# EAGLE design rs485board (EAGLE 8.7.0)
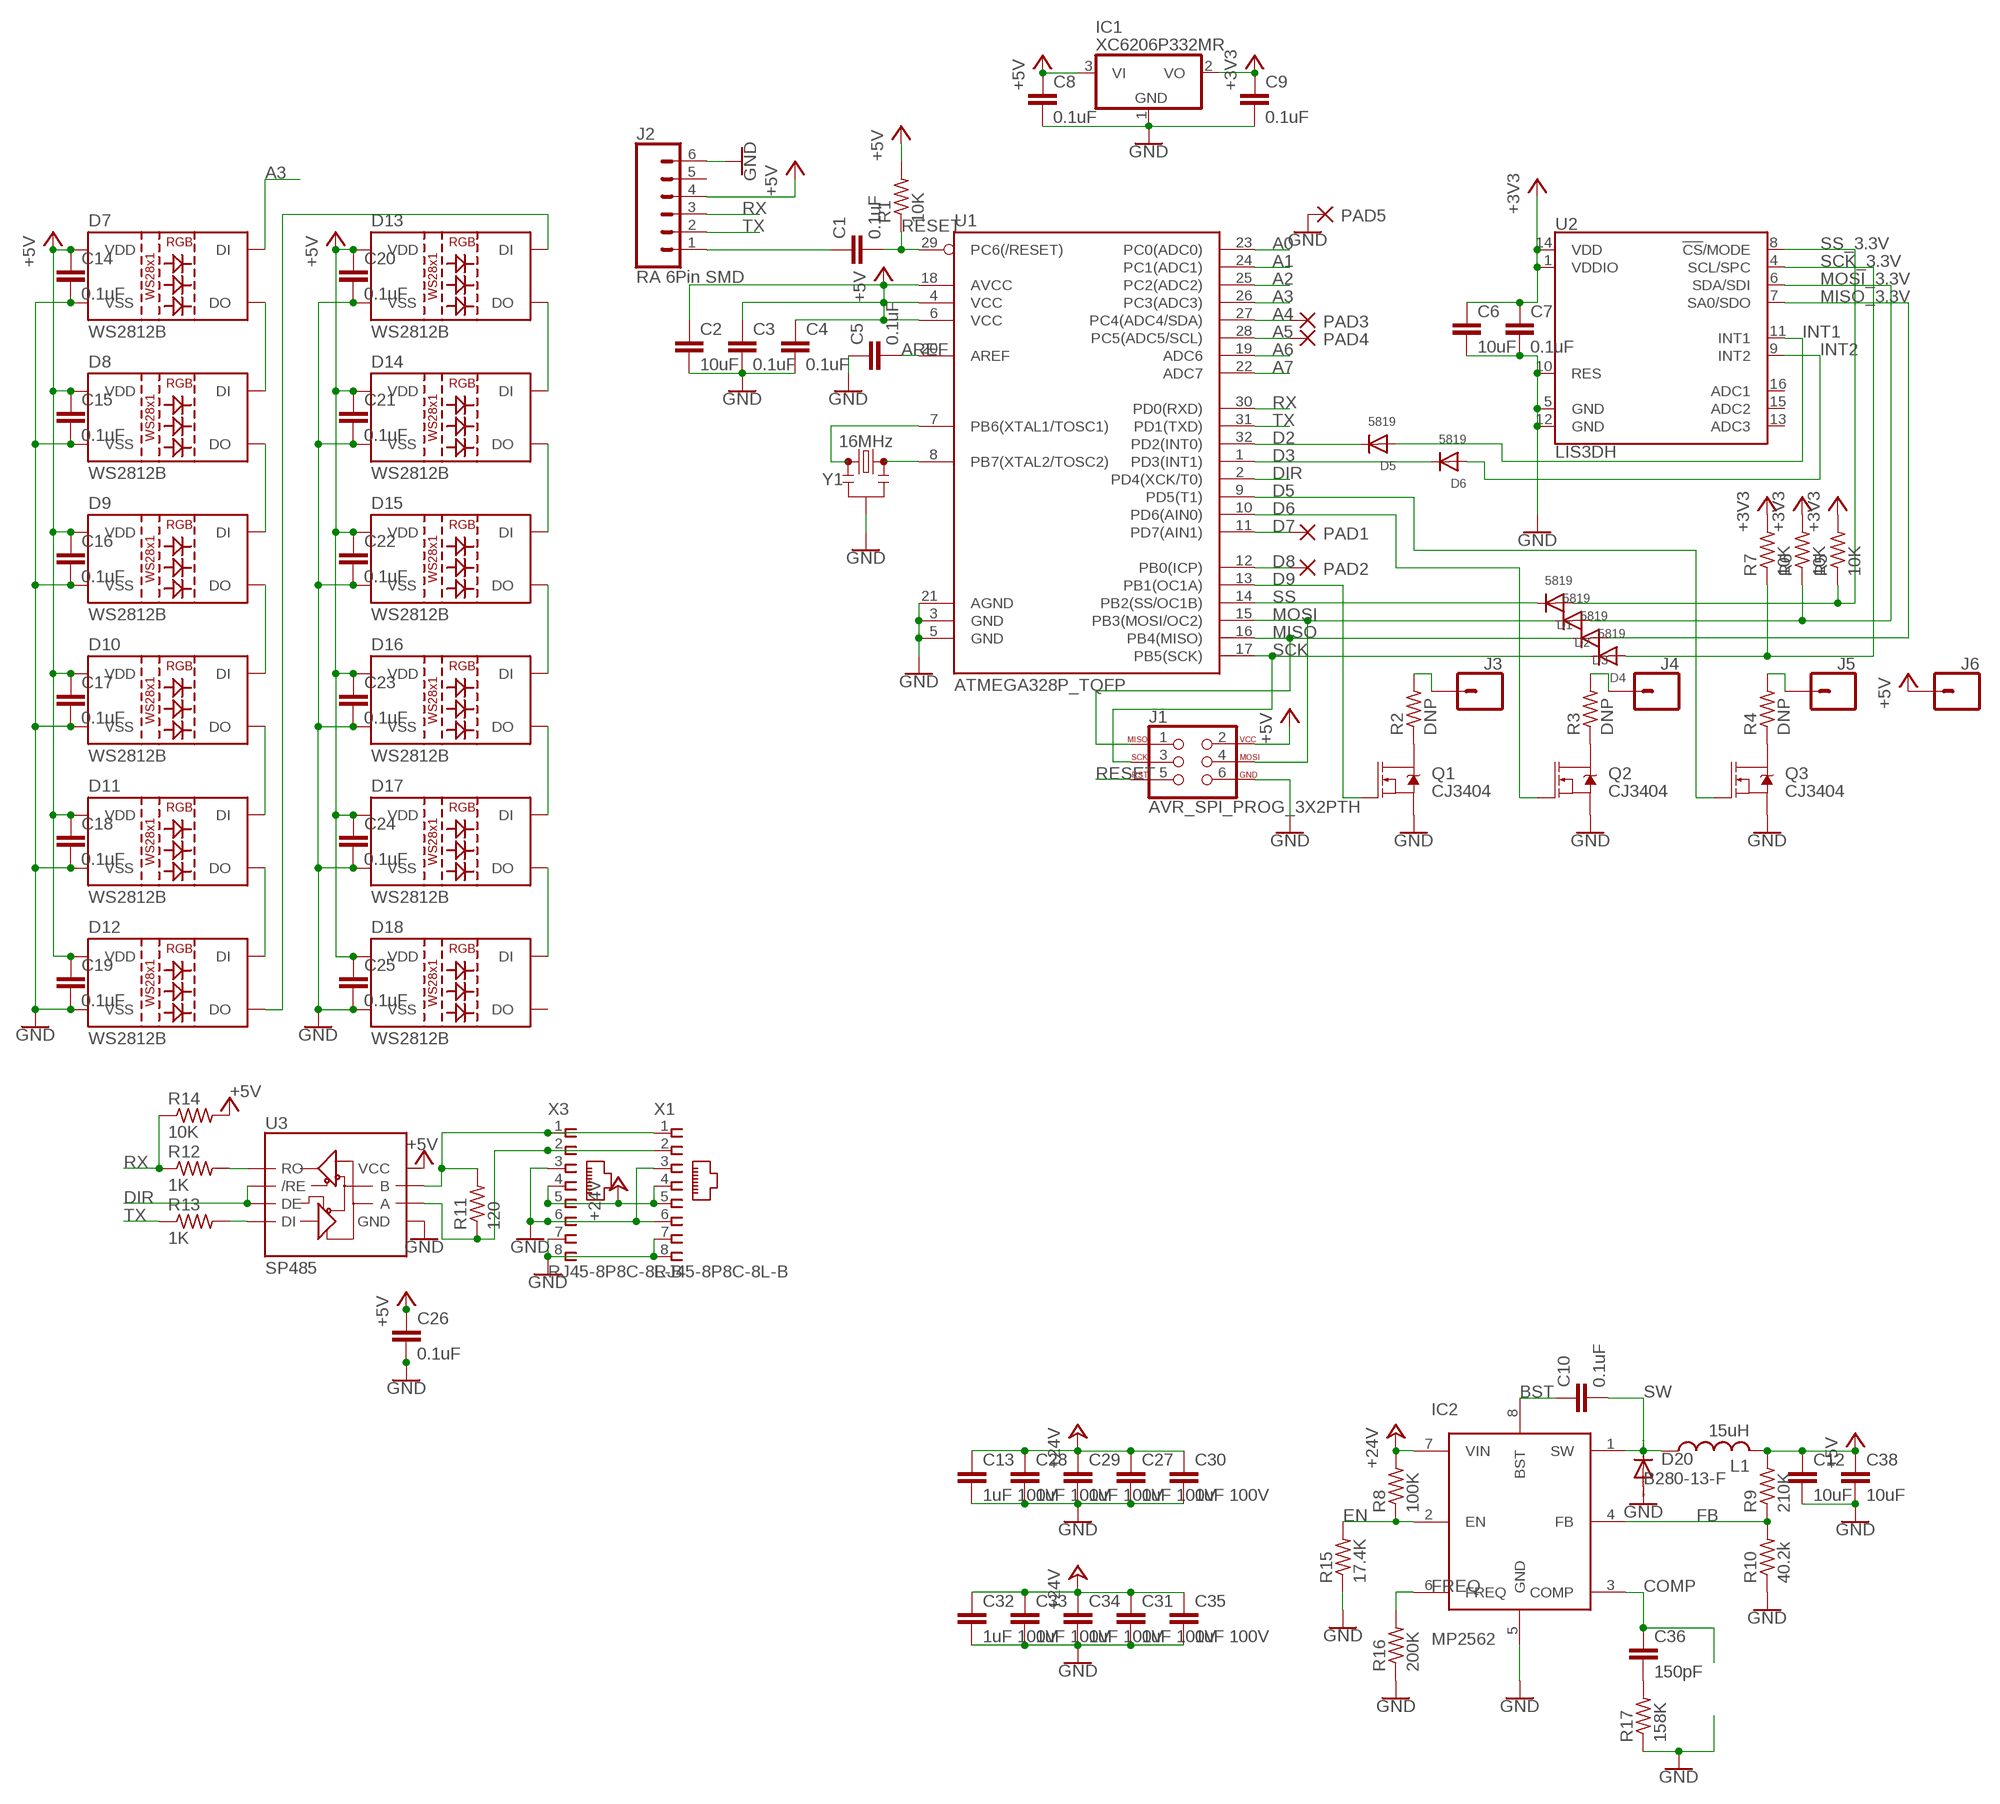
[diagram p0: schematic, sheet 1]

## Parts
C1  0.1uF  C-EUC0805K  [C0805K]
C2  10uF  C-EUC0805K  [C0805K]
C3  0.1uF  C-EUC0805K  [C0805K]
C4  0.1uF  C-EUC0805K  [C0805K]
C5  0.1uF  C-EUC0805K  [C0805K]
C6  10uF  C-EUC0805K  [C0805K]
C7  0.1uF  C-EUC0805K  [C0805K]
C8  0.1uF  C-EUC0805K  [C0805K]
C9  0.1uF  C-EUC0805K  [C0805K]
C10  0.1uF  C-EUC0805K  [C0805K]
C12  10uF  C-EUC0805K  [C0805K]
C13  1uF 100V  10UF-1206-6.3V-20%  [1206]
C14  0.1uF  C-EUC0805K  [C0805K]
C15  0.1uF  C-EUC0805K  [C0805K]
C16  0.1uF  C-EUC0805K  [C0805K]
C17  0.1uF  C-EUC0805K  [C0805K]
C18  0.1uF  C-EUC0805K  [C0805K]
C19  0.1uF  C-EUC0805K  [C0805K]
C20  0.1uF  C-EUC0805K  [C0805K]
C21  0.1uF  C-EUC0805K  [C0805K]
C22  0.1uF  C-EUC0805K  [C0805K]
C23  0.1uF  C-EUC0805K  [C0805K]
C24  0.1uF  C-EUC0805K  [C0805K]
C25  0.1uF  C-EUC0805K  [C0805K]
C26  0.1uF  C-EUC0805K  [C0805K]
C27  1uF 100V  10UF-1206-6.3V-20%  [1206]
C28  1uF 100V  10UF-1206-6.3V-20%  [1206]
C29  1uF 100V  10UF-1206-6.3V-20%  [1206]
C30  1uF 100V  10UF-1206-6.3V-20%  [1206]
C31  1uF 100V  10UF-1206-6.3V-20%  [1206]
C32  1uF 100V  10UF-1206-6.3V-20%  [1206]
C33  1uF 100V  10UF-1206-6.3V-20%  [1206]
C34  1uF 100V  10UF-1206-6.3V-20%  [1206]
C35  1uF 100V  10UF-1206-6.3V-20%  [1206]
C36  150pF  C-EUC0805K  [C0805K]
C38  10uF  C-EUC0805K  [C0805K]
D1  5819  DIODESOD-123  [SOD-123]
D2  5819  DIODESOD-123  [SOD-123]
D3  5819  DIODESOD-123  [SOD-123]
D4  5819  DIODESOD-123  [SOD-123]
D5  5819  DIODESOD-123  [SOD-123]
D6  5819  DIODESOD-123  [SOD-123]
D7  WS2812B  [WS2812B]
D8  WS2812B  [WS2812B]
D9  WS2812B  [WS2812B]
D10  WS2812B  [WS2812B]
D11  WS2812B  [WS2812B]
D12  WS2812B  [WS2812B]
D13  WS2812B  [WS2812B]
D14  WS2812B  [WS2812B]
D15  WS2812B  [WS2812B]
D16  WS2812B  [WS2812B]
D17  WS2812B  [WS2812B]
D18  WS2812B  [WS2812B]
D20  B280-13-F  DIODE-DO214AA  [DO214AA]
IC1  XC6206P332MR  MCP1703CB  [SOT23]
IC2  MP2562  [SO08]
J1  AVR_SPI_PROG_3X2PTH  [2X3]
J2  RA 6Pin SMD  CONN_06SMD  [1X06-SMD_RA_MALE]
J3  CONN_01  [1X01]
J4  CONN_01  [1X01]
J5  CONN_01  [1X01]
J6  CONN_01  [1X01]
L1  15uH  SLF12575T  [SLF12575]
PAD1  1,6/0,8  [1,6/0,8]
PAD2  1,6/0,8  [1,6/0,8]
PAD3  1,6/0,8  [1,6/0,8]
PAD4  1,6/0,8  [1,6/0,8]
PAD5  1,6/0,8  [1,6/0,8]
Q1  CJ3404  MOSFET-NCH-AO3404A  [SOT23-3]
Q2  CJ3404  MOSFET-NCH-AO3404A  [SOT23-3]
Q3  CJ3404  MOSFET-NCH-AO3404A  [SOT23-3]
R1  10K  R-US_R0805  [R0805]
R2  DNP  R-US_R0805  [R0805]
R3  DNP  R-US_R0805  [R0805]
R4  DNP  R-US_R0805  [R0805]
R5  10K  R-US_R0805  [R0805]
R6  10K  R-US_R0805  [R0805]
R7  10K  R-US_R0805  [R0805]
R8  100K  R-US_R0805  [R0805]
R9  210K  R-US_R0805  [R0805]
R10  40.2k  R-US_R0805  [R0805]
R11  120  R-US_R0805  [R0805]
R12  1K  R-US_R0805  [R0805]
R13  1K  R-US_R0805  [R0805]
R14  10K  R-US_R0805  [R0805]
R15  17.4K  R-US_R0805  [R0805]
R16  200K  R-US_R0805  [R0805]
R17  158K  R-US_R0805  [R0805]
U1  ATMEGA328P_TQFP  [TQFP32-08]
U2  LIS3DH  [LGA-16-3X3]
U3  SP485  RS485SOIC  [SO08]
X1  RJ45-8P8C-8L-B  [RJ45-SHIELD-DS1128-S80BP]
X3  RJ45-8P8C-8L-B  [RJ45-SHIELD-DS1128-S80BP]
Y1  16MHz  RESONATOR-16MHZSMD_3.2X1.3  [RESONATOR-SMD-3.2X1.3]

## Nets
+3V3: C6.1 C7.1 C9.1 IC1.2(VO) R5.2 R6.2 R7.2 U2.1(VDDIO) U2.14(VDD)
+5V: C2.1 C3.1 C4.1 C8.1 C12.1 C14.1 C15.1 C16.1 C17.1 C18.1 C19.1 C20.1 C21.1 C22.1 C23.1 C24.1 C25.1 C26.1 C38.1 D7.1(VDD) D8.1(VDD) D9.1(VDD) D10.1(VDD) D11.1(VDD) D12.1(VDD) D13.1(VDD) D14.1(VDD) D15.1(VDD) D16.1(VDD) D17.1(VDD) D18.1(VDD) IC1.3(VI) J1.2 J2.4 J6.1 L1.P$2 R1.2 R9.2 R14.2 U1.4(VCC) U1.6(VCC) U1.18(AVCC) U3.8(VCC)
+24V: C13.1 C27.1 C28.1 C29.1 C30.1 C31.1 C32.1 C33.1 C34.1 C35.1 IC2.7(VIN) R8.2 X1.4 X1.5 X3.4 X3.5
A0: U1.23(PC0(ADC0))
A1: U1.24(PC1(ADC1))
A2: U1.25(PC2(ADC2))
A3: D7.4(DI) U1.26(PC3(ADC3))
A4: PAD3.1(P) U1.27(PC4(ADC4/SDA))
A5: PAD4.1(P) U1.28(PC5(ADC5/SCL))
A6: U1.19(ADC6)
A7: U1.22(ADC7)
AREF: C5.2 U1.20(AREF)
BST: C10.1 IC2.8(BST)
COMP: C36.1 IC2.3(COMP)
D2: D5.C U1.32(PD2(INT0))
D3: D6.C U1.1(PD3(INT1))
D5: Q3.1(G) U1.9(PD5(T1))
D6: Q2.1(G) U1.10(PD6(AIN0))
D7: PAD1.1(P) U1.11(PD7(AIN1))
D8: PAD2.1(P) U1.12(PB0(ICP))
D9: Q1.1(G) U1.13(PB1(OC1A))
DIR: U1.2(PD4(XCK/T0)) U3.2(/RE) U3.3(DE)
EN: IC2.2(EN) R8.1 R15.2
FB: IC2.4(FB) R9.1 R10.2
FREQ: IC2.6(FREQ) R16.2
GND: C2.2 C3.2 C4.2 C5.1 C6.2 C7.2 C8.2 C9.2 C12.2 C13.2 C14.2 C15.2 C16.2 C17.2 C18.2 C19.2 C20.2 C21.2 C22.2 C23.2 C24.2 C25.2 C26.2 C27.2 C28.2 C29.2 C30.2 C31.2 C32.2 C33.2 C34.2 C35.2 C38.2 D7.3(VSS) D8.3(VSS) D9.3(VSS) D10.3(VSS) D11.3(VSS) D12.3(VSS) D13.3(VSS) D14.3(VSS) D15.3(VSS) D16.3(VSS) D17.3(VSS) D18.3(VSS) D20.A IC1.1(GND) IC2.5(GND) J1.6 J2.6 PAD5.1(P) Q1.2(S) Q2.2(S) Q3.2(S) R10.1 R15.1 R16.1 R17.1 U1.3(GND) U1.5(GND) U1.21(AGND) U2.5(GND) U2.10(RES) U2.12(GND) U3.5(GND) X1.3 X1.6 X1.7 X1.8 X3.3 X3.6 X3.7 X3.8 Y1.2
INT1: D5.A U2.11(INT1)
INT2: D6.A U2.9(INT2)
MISO: D3.C J1.1 U1.16(PB4(MISO))
MISO_3.3V: D3.A U2.7(SA0/SDO)
MOSI: D2.C J1.4 U1.15(PB3(MOSI/OC2))
MOSI_3.3V: D2.A R6.1 U2.6(SDA/SDI)
N$1: Q1.3(D) R2.1
N$2: D7.2(DO) D8.4(DI)
N$3: D8.2(DO) D9.4(DI)
N$4: J3.1 R2.2
N$5: Q2.3(D) R3.1
N$6: J4.1 R3.2
N$7: Q3.3(D) R4.1
N$8: J5.1 R4.2
N$9: D9.2(DO) D10.4(DI)
N$10: D10.2(DO) D11.4(DI)
N$11: D11.2(DO) D12.4(DI)
N$12: D12.2(DO) D13.4(DI)
N$13: D13.2(DO) D14.4(DI)
N$14: D14.2(DO) D15.4(DI)
N$15: D15.2(DO) D16.4(DI)
N$16: D16.2(DO) D17.4(DI)
N$17: D17.2(DO) D18.4(DI)
N$25: C36.2 R17.2
N$30: R12.2 U3.1(RO)
N$31: R13.2 U3.4(DI)
RESET: C1.2 J1.5 R1.1 U1.29(PC6(/RESET))
RESET_EXT: C1.1 J2.1
RS485A: R11.1 U3.6(A) X1.2 X3.2
RS485B: R11.2 U3.7(B) X1.1 X3.1
RX: J2.3 R12.1 R14.1 U1.30(PD0(RXD))
SCK: D4.C J1.3 U1.17(PB5(SCK))
SCK_3.3V: D4.A R7.1 U2.4(SCL/SPC)
SS: D1.C U1.14(PB2(SS/OC1B))
SS_3.3V: D1.A R5.1 U2.8(!CS!/MODE)
SW: C10.2 D20.C IC2.1(SW) L1.P$1
TX: J2.2 R13.1 U1.31(PD1(TXD))
XTAL1: U1.7(PB6(XTAL1/TOSC1)) Y1.1
XTAL2: U1.8(PB7(XTAL2/TOSC2)) Y1.3
Unconnected: D18.2(DO) J2.5 U2.13(ADC3) U2.15(ADC2) U2.16(ADC1)

## Library data of the parts
C1 C3-C5 C7-C10 C14-C26 = resistor:C-EU: CAPACITOR, European symbol; LCSC: C29926
C2 C6 C12 C38 = resistor:C-EU: CAPACITOR, European symbol; LCSC: C92341
C13 C27-C35 = SparkFun-Capacitors:10UF: 10.0µF ceramic capacitors A capacitor is a passive two-terminal electrical component used to store electrical energy temporarily in an electric field.; LCSC: C91151; PROD_ID: CAP-10057; VALUE: 10uF
C36 = resistor:C-EU: CAPACITOR, European symbol; LCSC: C152846
D1-D6 = adafruit:DIODE: Diode SMADIODE - SMA Surface Mount Package 20V 1A Schottky Diode Digikey: 641-1014-6-ND DO-1N4148 - Through Hole Small Current Diode SOD-123 20V 1 A (.5mV Vf) Schottky Diode - Digikey: MBRX120TPMSCT-ND SOD-323 10V 570mA (.38mV Vf, 3ns) Schottky Diode - Digikey: ZLLS410CT-ND SOD-523 30V 30mA Schottky Diode (RB751S-40TE61) - Digikey: RB751S-40TE61CT-ND SOT23-R/W - SOT23 Package (R = Solder Paste/Reflow Ovens, W = Hand-Soldering) BAT54Film 40V 300mA - Digikey: 497-7162-1-ND; LCSC: C64885
D7-D18 = SparkFun-LED:WS2812B: WS2812B SMD addressable RGB LED 5x5mm SMD LED with built-in controller IC. Color: Red/Green/Blue mC Rating: RGB: 390, 660, 180 mcd Forward Voltage: RGB: 2.0, 3.0, 3.0 V Packages:WS2812B SparkFun Products: Blynk Board - ESP8266 <https://www.sparkfun.com/products/13794>; LCSC: C114585; PROD_ID: DIO-12503
D20 = diode:DIODE-: DIODE; LCSC: C134445
IC1 = linear:MCP1703: 250 mA, 16V, Low Quiescent Current LDO Regulator Source: http://ww1.microchip.com/downloads/en/DeviceDoc/22049b.pdf; LCSC: C5446
IC2 = misc:MP2562; LCSC: C93647
J1 = SparkFun-Connectors:AVR_SPI_PROG_3X2: AVR ISP 6 Pin This is the reduced ISP connector for AVR programming. Common on Arduino. This footprint will take up less PCB space and can be used with a 10-pin to 6-pin adapter such as SKU: BOB-08508 **Special note about "TEST_POINT" package. The stop mask is on the top side, so if you want your programming test points to be on the bottom of your board, make sure to place this package on the bottom side of the board. This also ensure that the orientation to program from the bottom side will be correct. SparkFun Products: SparkFun ISP Pogo Adapter <https://www.sparkfun.com/products/11591> - NS Tiny AVR Programmer <https://www.sparkfun.com/products/11801> -PTH
J2 = SparkFun-Connectors:CONN_06: Multi connection point. Often used as Generic Header-pin footprint for 0.1 inch spaced/style header connections On any of the 0.1 inch spaced packages, you can populate with these: Break Away Headers - Straight <https://www.sparkfun.com/products/116> (PRT-00116) Break Away Male Headers - Right Angle <https://www.sparkfun.com/products/553> (PRT-00553) Female Headers <https://www.sparkfun.com/products/115> (PRT-00115) Break Away Headers - Machine Pin <https://www.sparkfun.com/products/117> (PRT-00117) Break Away Female Headers - Swiss Machine Pin <https://www.sparkfun.com/products/743> (PRT-00743) Arduino Stackable Header - 6 Pin <https://www.sparkfun.com/products/9280> (PRT-09280) For SCREWTERMINALS and SPRING TERMINALS visit here: Screw Terimnals on SparkFun.com <https://www.sparkfun.com/search/results?term=Screw+Terminals> (5mm/3.5mm/2.54mm spacing) This device is also useful as a general connection point to wire up your design to another part of your project. Our various solder wires solder well into these plated through hole pads. Hook-Up Wire - Assortment (Stranded, 22 AWG) <https://www.sparkfun.com/products/11375> (PRT-11375) Hook-Up Wire - Assortment (Solid Core, 22 AWG) <https://www.sparkfun.com/products/11367> (PRT-11367) View the entire wire category on our website here <https://www.sparkfun.com/categories/141>; PROD_ID: CONN-08971
J3-J6 = SparkFun-Connectors:CONN_01: Single connection point. Often used as Generic Header-pin footprint for 0.1 inch spaced/style header connections On any of the 0.1 inch spaced packages, you can populate with these: Break Away Headers - Straight <https://www.sparkfun.com/products/116> (PRT-00116) Break Away Male Headers - Right Angle <https://www.sparkfun.com/products/553> (PRT-00553) Female Headers <https://www.sparkfun.com/products/115> (PRT-00115) Break Away Headers - Machine Pin <https://www.sparkfun.com/products/117> (PRT-00117) Break Away Female Headers - Swiss Machine Pin <https://www.sparkfun.com/products/743> (PRT-00743) This device is also useful as a general connection point to wire up your design to another part of your project. Our various solder wires solder well into these plated through hole pads. Hook-Up Wire - Assortment (Stranded, 22 AWG) <https://www.sparkfun.com/products/11375> (PRT-11375) Hook-Up Wire - Assortment (Solid Core, 22 AWG) <https://www.sparkfun.com/products/11367> (PRT-11367) View the entire wire category on our website here <https://www.sparkfun.com/categories/141> Special notes: SMTSO-256-ET is a "flush mount" nut for a 4-40 screw. We mostly use this on specialty testbeds; it is a nice way to connect hardware to your PCB at an adjustable hieght. Also note, the SNAP packages are for using a snappable style connector. We sell a baggie of snaps and they are also used on two LilyPad designs: Snap Assortment - 30 pack (male and female) <https://www.sparkfun.com/products/11347> (DEV-11347) LilyPad Arduino SimpleSnap <https://www.sparkfun.com/products/10941> (DEV-10941) LilyPad SimpleSnap Protoboard <https://www.sparkfun.com/products/10940> (DEV-10940)
L1 = misc:SLF12575T; LCSC: C136211
PAD1-PAD5 = wirepad:1,6/0,8: THROUGH-HOLE PAD
Q1-Q3 = SparkFun-DiscreteSemi:MOSFET-NCH: N-channel MOSFETs Voltage controlled devices that allow control of high current outputs. SparkFun Products: SparkFun OpenScale <https://www.sparkfun.com/products/13261> SparkFun Digital Sandbox <https://www.sparkfun.com/products/12651> SparkFun Monster Moto Shield <https://www.sparkfun.com/products/10182> SparkFun MOSFET Power Controller <https://www.sparkfun.com/products/11214>; PROD_ID: TRANS-12988; VALUE: 5.8A/30V/35mΩ
R1 R5-R7 R14 = resistor:R-US_: RESISTOR, American symbol; LCSC: C17414
R2-R4 R11 = resistor:R-US_: RESISTOR, American symbol
R8 = resistor:R-US_: RESISTOR, American symbol; LCSC: C96346
R9 = resistor:R-US_: RESISTOR, American symbol; LCSC: C170839
R10 = resistor:R-US_: RESISTOR, American symbol; LCSC: C104303
R12 R13 = resistor:R-US_: RESISTOR, American symbol; LCSC: C115316
R15 = resistor:R-US_: RESISTOR, American symbol; LCSC: C144583
R16 = resistor:R-US_: RESISTOR, American symbol; LCSC: C17539
R17 = resistor:R-US_: RESISTOR, American symbol; LCSC: C104013
U1 = SparkFun-IC-Microcontroller:ATMEGA328P_TQFP: Popular 328P in QFP Storefront component: ATmega328 - TQFP <https://www.sparkfun.com/products/13448> (COM-13448) Datasheet <http://www.sparkfun.com/datasheets/Components/SMD/ATMega328.pdf> SparkFun Products SparkFun RedBoard - Programmed with Arduino <https://www.sparkfun.com/products/12757> (DEV-12757) Arduino Pro Mini 328 - 5V/16MHz <https://www.sparkfun.com/products/11113> (DEV-11113) Arduino Pro Mini 328 - 3.3V/8MHz <https://www.sparkfun.com/products/11114> (DEV-11114) SparkFun OpenLog <https://www.sparkfun.com/products/13712> (DEV-13712) SparkFun MicroView - OLED Arduino Module <https://www.sparkfun.com/products/12923> (DEV-12923) SparkFun Digital Sandbox <https://www.sparkfun.com/products/12651> (DEV-12651) SparkFun PicoBoard <https://www.sparkfun.com/products/11888> (WIG-11888) Arduino Fio <https://www.sparkfun.com/products/10116> (DEV-10116) LilyPad Arduino 328 Main Board <https://www.sparkfun.com/products/13342> (DEV-13342) SparkFun RedStick <https://www.sparkfun.com/products/13741> (DEV-13741) LilyPad MP3 <https://www.sparkfun.com/products/11013> (DEV-11013) LilyPad Arduino SimpleSnap <https://www.sparkfun.com/products/10941> (DEV-10941) SparkFun Stepoko <https://www.sparkfun.com/products/13899> (ROB-13899) SparkFun Geiger Counter <https://www.sparkfun.com/products/11345> (SEN-11345) SparkFun EL Sequencer <https://www.sparkfun.com/products/12781> (COM-12781) Arduino Pro 328 - 5V/16MHz <https://www.sparkfun.com/products/10915> (DEV-10915) CryptoCape <https://www.sparkfun.com/products/12773> (DEV-12773) SparkFun IR Thermometer Evaluation Board - MLX90614 <https://www.sparkfun.com/products/10740> (SEN-10740) SparkFun RedBot Mainboard <https://www.sparkfun.com/products/12097> (ROB-12097) Arduino Pro 328 - 3.3V/8MHz <https://www.sparkfun.com/products/10914> (DEV-10914) SparkFun Block for Intel® Edison - Arduino <https://www.sparkfun.com/products/13036> (DEV-13036) SparkFun Simon Says - Surface Mount Soldering Kit <https://www.sparkfun.com/products/10935> (KIT-10935) SparkFun 7-Segment Serial Display - Red <https://www.sparkfun.com/products/11441> (COM-11441) SparkFun 7-Segment Serial Display - White <https://www.sparkfun.com/products/11629> (COM-11629) SparkFun 7-Segment Serial Display - Yellow <https://www.sparkfun.com/products/11443> (COM-11443) SparkFun 7-Segment Serial Display - Kelly Green <https://www.sparkfun.com/products/11440> (COM-11440) SparkFun 7-Segment Serial Display - Blue <https://www.sparkfun.com/products/11442> (COM-11442) SparkFun OpenSegment Serial Display - 20mm (Blue) <https://www.sparkfun.com/products/11647> (COM-11647) SparkFun OpenSegment Serial Display - 20mm (Green) <https://www.sparkfun.com/products/11646> (COM-11646) SparkFun OpenSegment Serial Display - 20mm (White) <https://www.sparkfun.com/products/11648> (COM-11648) SparkFun OpenSegment Serial Display - 20mm (Red) <https://www.sparkfun.com/products/11644> (COM-11644) SparkFun OpenSegment Serial Display - 20mm (Yellow) <https://www.sparkfun.com/products/11645> (COM-11645) SparkFun OpenSegment Shield <https://www.sparkfun.com/products/13190> (DEV-13190); LCSC: C14877; PROD_ID: IC-09069
U2 = SparkFun-Sensors:LIS3DH: ST Microelectronics LIS3DH 3-Axis ±2/4/8/16g SPI/I2C Accelerometer The LIS3DH is a three axis MEMS linear accelerometer in the "nano" family. It has a digital I2C/SPI serial interface which makes it ideal for using in embedded applications. The device also features ultra low-power operational modes that allow advanced power saving and smart sleep to wake-up functions, built in detections with interrupts, and auxiliary ADC inputs Datasheet-XXXX <http://www.sparkfun.com/datasheets/Sensors/Accelerometer/LIS3DH.pdf> SparkFun Products SparkFun Triple Axis Accelerometer Breakout - LIS3DH <https://www.sparkfun.com/products/10345> (SEN-XXXXX) Triple Axis Accelerometer - LIS3DH <https://www.sparkfun.com/products/9755> (SEN-XXXXX); LCSC: C15134; PROD_ID: IC-13419; SF_ID: N/A
U3 = SparkFun-IC-Comms:RS485: RS-485 Transceiver SP3485 Series 8 Pin NSOIC 3.3 V Low Power Half Duplex RS-485 Transceiver MAX3485 compatible Datasheet <http://www.sparkfun.com/datasheets/Components/General/sp3485CN-LTR.pdf> SparkFun Products SparkFun Transceiver Breakout - RS-485 <https://www.sparkfun.com/products/10124> (BOB-10124) SparkFun USB to RS-485 Converter <https://www.sparkfun.com/products/9822> (BOB-09822); LCSC: C6855; PROD_ID: IC-09388; VALUE: MAX3485CSA
X1 X3 = myownParts:RJ45-8P8C: CORCOM Modular RJ Jacks No Shield Source: www.tycoelectronics.com .. ENG_DS_1654001_1099_RJ_L_0507.pdf; LCSC: C86586; MF: TYCO ELECTRONICS; MPN: RJ45-8L-B; OC_FARNELL: 1279843; OC_NEWARK: 52K4445
Y1 = SparkFun-Clocks:RESONATOR-16MHZ: 16MHz Resonator Digikey Example <http://www.digikey.com/product-detail/en/murata-electronics-north-america/CSTCE16M0V53-R0/490-1198-1-ND/584635> Frequency: 16MHz Frequency Stability: ±0.3% Frequency Tolerance: ±0.5% Capacitance: 15pF SparkFun Products SparkFun OpenLog <https://www.sparkfun.com/products/13712> SparkFun MicroView - OLED Arduino Module <https://www.sparkfun.com/products/12923>; LCSC: C91584; PROD_ID: XTAL-08900

## Board
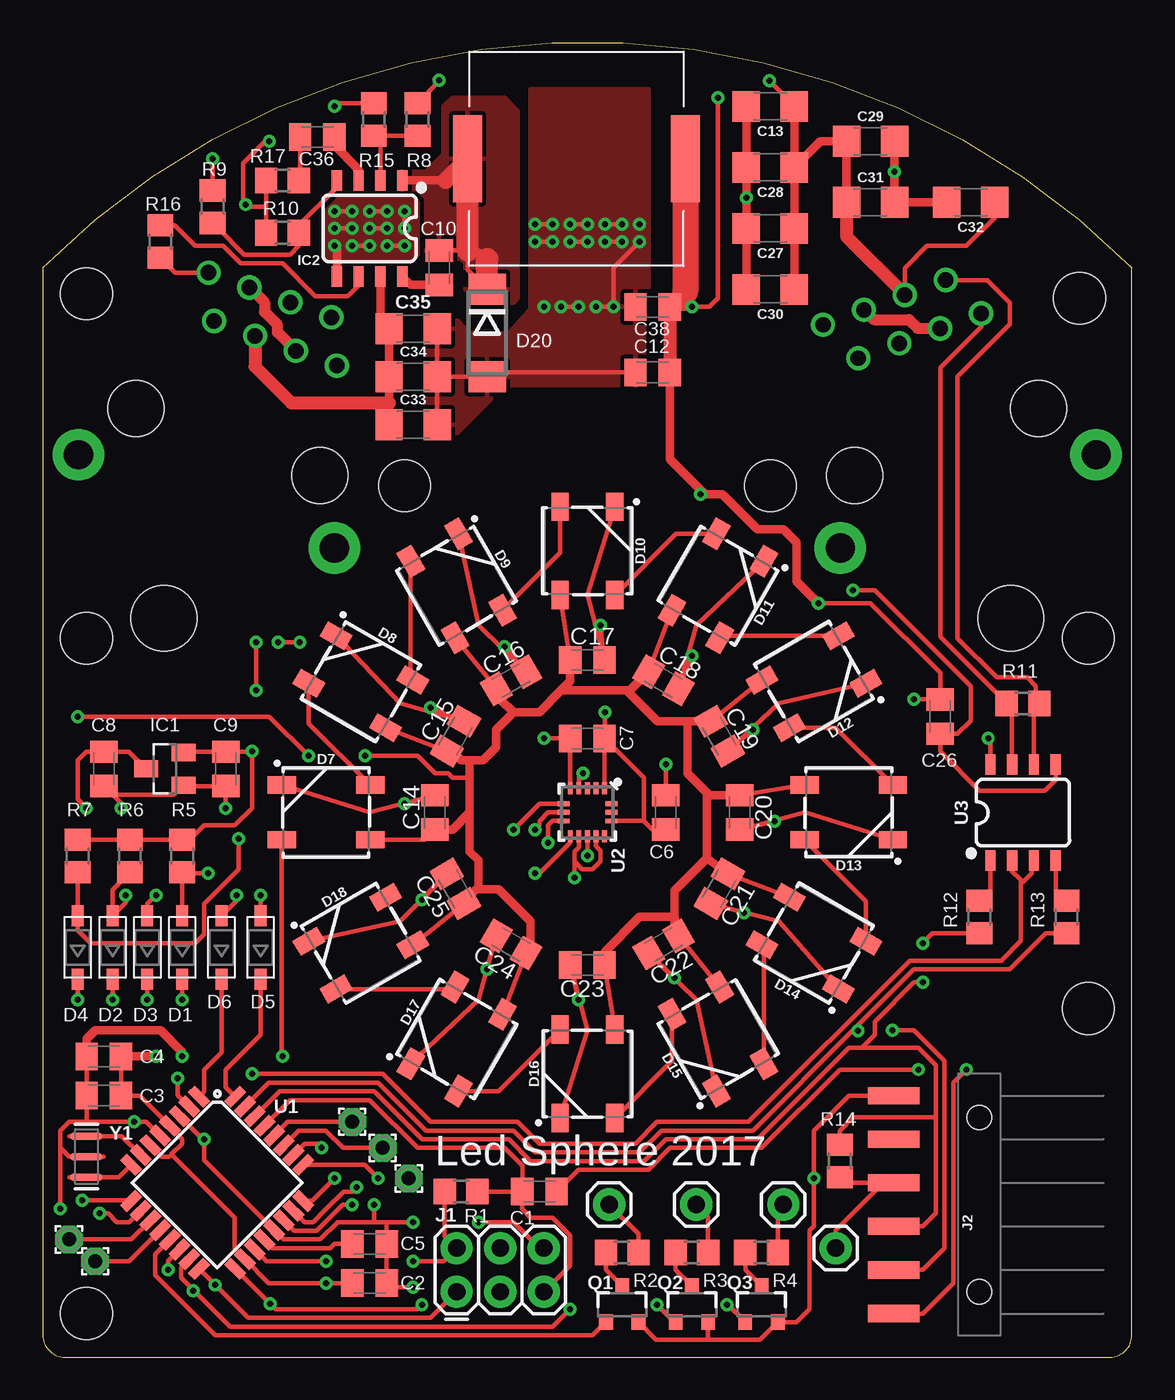
[diagram p1: board, top side]
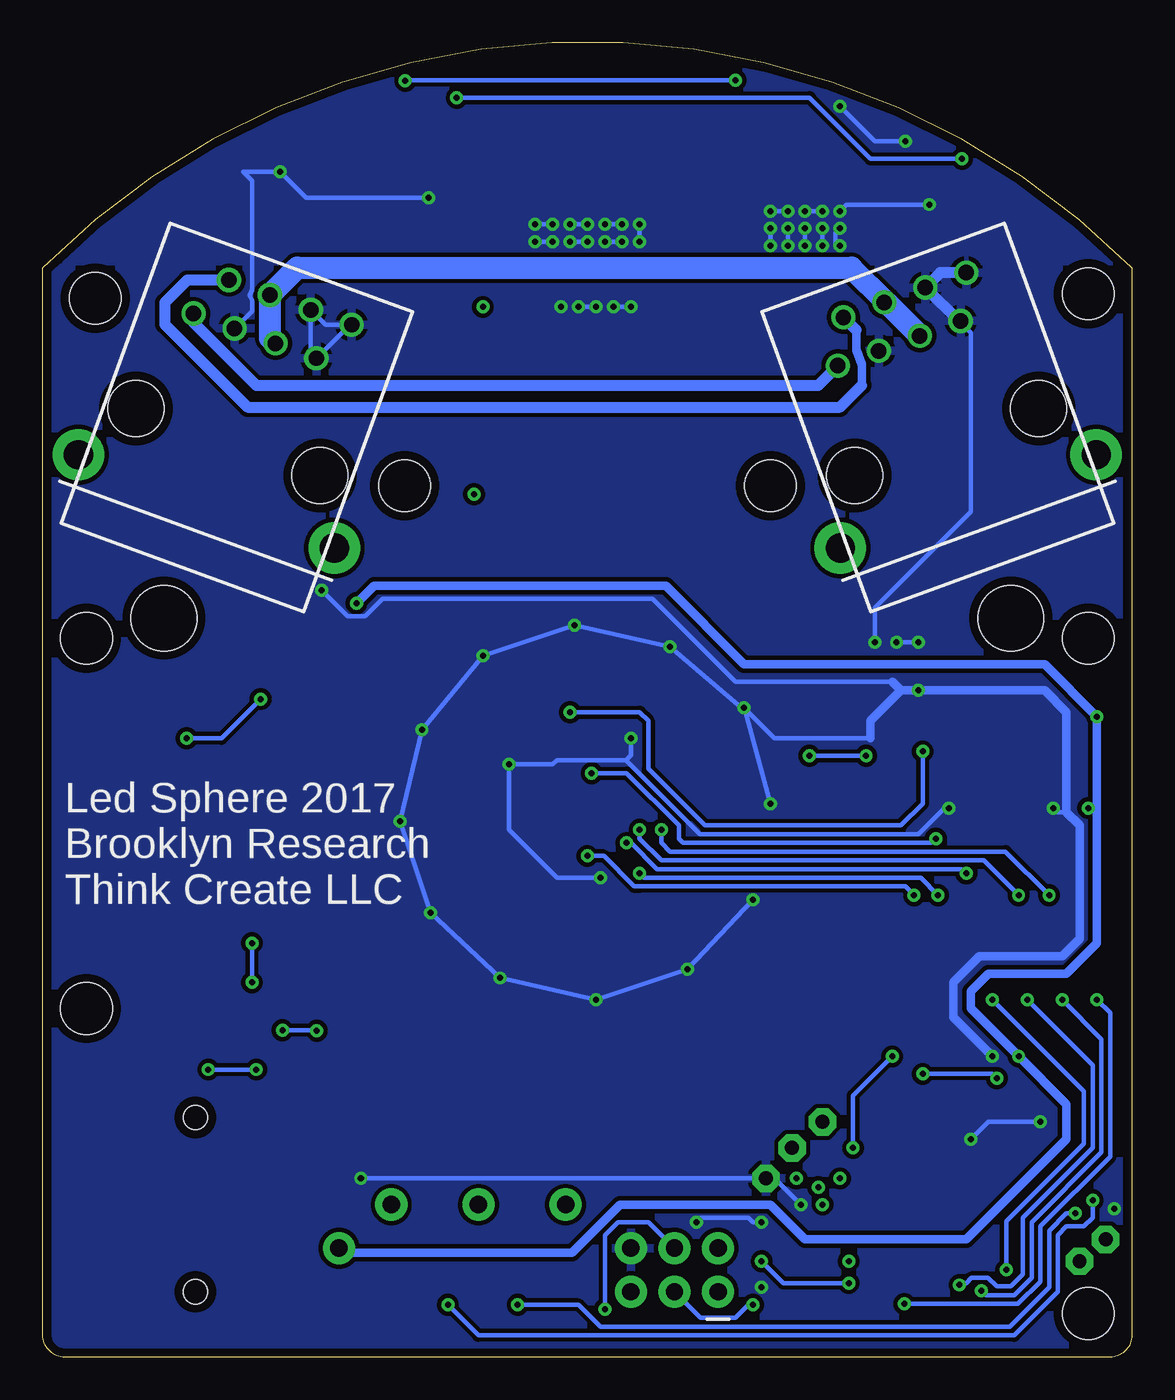
[diagram p2: board, bottom side, seen from below]

Size 63.5 x 76.6 mm. Coordinates in mm from the lower left corner, seen from the top.
Outline: 1.27,0 62.23,0 arc90 63.5,1.27 63.5,63.5 arc90 0,63.5 0,1.27 arc90 1.27,0
Copper layers (1*16): Top 0.035mm / dielectric 1.5mm / Bottom 0.035mm
Design rules "eagleRules *": minimum track width 10mil, minimum drill 0.3mm, track to track 10mil, track to pad 10mil, pad to pad 8mil, via to via 10mil, smd to smd 8mil, copper to edge 20mil, drill to drill 20mil, minimum pad ring 10mil, minimum via ring 8mil, stop-mask expansion 4mil, vias tented up to drill 14mil, thermal gap 10mil
Holes 3 mm at 2.54,2.54 60.96,20.32 2.54,41.91 60.96,41.91 21.08,50.8 42.42,50.8 2.54,61.98 60.45,61.72
Holes 3.81 mm at 7.06,43.08 56.44,43.08

### Footprints (pad centres in the part's own frame; a part is rotated, then mirrored left to right if it is on the bottom)
C0805K = smd 1.3 x 1.6: 1 -1,0; 2 1,0
1206 = smd 1.6 x 1.8: 1 -1.4,0; 2 1.4,0
SOD-123 = smd 1.2 x 0.7: A 1.85,0; C -1.85,0
WS2812B = smd 1.651 x 1: 1 2.577,-1.6; 2 2.577,1.6; 3 -2.577,1.6; 4 -2.577,-1.6
DO214AA = smd 1.8 x 2.2: A 2.55,0; C -2.55,0
SOT23 = smd 1 x 1.4: 1 -0.95,-1.1; 2 0.95,-1.1; 3 0,1.1
SO08 = smd 0.6 x 1.2: 1 -1.905,-2.8; 2 -0.635,-2.8; 3 0.635,-2.8; 4 1.905,-2.8; 5 1.905,2.8; 6 0.635,2.8; 7 -0.635,2.8; 8 -1.905,2.8
2X3 = drill 1.016 pad 1.88: 1 0,0; 2 0,2.54; 3 2.54,0; 4 2.54,2.54; 5 5.08,0; 6 5.08,2.54
1X06-SMD_RA_MALE = smd 1 x 3: 1 -6.35,5; 2 -3.81,5; 3 -1.27,5; 4 1.27,5; 5 3.81,5; 6 6.35,5 | hole 1.4: -5.08,0; 5.08,0
1X01 = drill 1.016 pad 1.88: 1 0,0
SLF12575 = smd 1.676 x 5.08: P$1 -6.35,0; P$2 6.35,0
1,6/0,8 = drill 0.813 pad 1.6 octagon: 1 0,0
SOT23-3 = smd 0.8 x 0.9: 1 -0.95,-1; 2 0.95,-1; 3 0,1.1
R0805 = smd 1.3 x 1.5: 1 -0.95,0; 2 0.95,0
TQFP32-08 = smd 1.27 x 0.559: 1 -4.293,2.8; 2 -4.293,2; 3 -4.293,1.2; 4 -4.293,0.4; 5 -4.293,-0.4; 6 -4.293,-1.2; 7 -4.293,-2; 8 -4.293,-2.8; 17 4.293,-2.8; 18 4.293,-2; 19 4.293,-1.2; 20 4.293,-0.4; 21 4.293,0.4; 22 4.293,1.2; 23 4.293,2; 24 4.293,2.8 | smd 0.559 x 1.27: 9 -2.8,-4.293; 10 -2,-4.293; 11 -1.2,-4.293; 12 -0.4,-4.293; 13 0.4,-4.293; 14 1.2,-4.293; 15 2,-4.293; 16 2.8,-4.293; 25 2.8,4.293; 26 2,4.293; 27 1.2,4.293; 28 0.4,4.293; 29 -0.4,4.293; 30 -1.2,4.293; 31 -2,4.293; 32 -2.8,4.293
LGA-16-3X3 = smd 0.7 x 0.28: 1 -1.4,1; 2 -1.4,0.5; 3 -1.4,0; 4 -1.4,-0.5; 5 -1.4,-1; 9 1.4,-1; 10 1.4,-0.5; 11 1.4,0; 12 1.4,0.5; 13 1.4,1 | smd 0.28 x 0.7: 6 -0.5,-1.4; 7 0,-1.4; 8 0.5,-1.4; 14 0.5,1.4; 15 0,1.4; 16 -0.5,1.4
RJ45-SHIELD-DS1128-S80BP = drill 0.9 pad 1.4: 1 -4.445,6.35; 2 -3.175,8.89; 3 -1.905,6.35; 4 -0.635,8.89; 5 0.635,6.35; 6 1.905,8.89; 7 3.175,6.35; 8 4.445,8.89 | drill 1.7 pad 3: SHIELD1 -7.94,-3.68; SHIELD2 7.94,-3.68 | hole 3.251: -5.715,0; 5.715,0
RESONATOR-SMD-3.2X1.3 = smd 0.45 x 1.905: 1 -1.2,0; 2 0,0; 3 1.2,0

### Placement (x,y rotation side)
C1  28.96,9.65 180 top
C2  19.05,4.32 0 top
C3  3.56,15.24 180 top
C4  3.56,17.53 180 top
C5  19.05,6.6 180 top
C6  36.32,31.75 90 top
C7  31.75,36.07 180 top
C8  3.56,34.29 270 top
C9  10.67,34.29 270 top
C10  23.11,63.5 90 top
C12  35.56,57.4 180 top
C13  42.42,72.9 180 top
C14  22.86,31.75 90 top
C15  24.05,36.2 60 top
C16  27.3,39.45 30 top
C17  31.75,40.64 0 top
C18  36.2,39.45 330 top
C19  39.45,36.2 300 top
C20  40.64,31.75 270 top
C21  39.45,27.3 240 top
C22  36.2,24.05 210 top
C23  31.75,22.86 180 top
C24  27.3,24.05 150 top
C25  24.05,27.3 120 top
C26  52.32,37.34 270 top
C27  42.42,65.79 180 top
C28  42.42,69.34 180 top
C29  48.26,70.87 0 top
C30  42.42,62.23 180 top
C31  48.26,67.31 0 top
C32  54.1,67.31 180 top
C33  21.59,54.36 0 top
C34  21.59,57.15 0 top
C35  21.59,59.94 0 top
C36  16,71.12 180 top
C38  35.56,61.21 180 top
D1  8.13,23.88 90 top
D2  4.06,23.88 90 top
D3  6.1,23.88 90 top
D4  2.03,23.88 90 top
D5  12.7,23.88 90 top
D6  10.41,23.88 90 top
D7  16.51,31.75 0 top
D8  18.54,39.37 330 top
D9  24.13,44.96 300 top
D10  31.75,46.99 270 top
D11  39.37,44.96 240 top
D12  44.96,39.37 210 top
D13  46.99,31.75 180 top
D14  44.96,24.13 150 top
D15  39.37,18.54 120 top
D16  31.75,16.51 90 top
D17  24.13,18.54 60 top
D18  18.54,24.13 30 top
D20  25.91,59.69 270 top
IC1  7.11,34.29 90 top
IC2  19.05,65.79 180 top
J1  24.13,3.81 0 top
J2  54.61,8.89 90 top
J3  33.02,8.89 0 top
J4  38.1,8.89 0 top
J5  43.18,8.89 0 top
J6  46.23,6.35 0 top
L1  31.11,69.85 0 top
PAD1  1.52,6.86 0 top
PAD2  3.05,5.59 0 top
PAD3  19.81,12.19 0 top
PAD4  18.03,13.72 0 top
PAD5  21.34,10.41 0 top
Q1  33.78,3.05 0 top
Q2  37.85,3.05 0 top
Q3  41.91,3.05 0 top
R1  24.38,9.65 180 top
R2  33.78,6.1 0 top
R3  37.85,6.1 0 top
R4  41.91,6.1 0 top
R5  8.13,29.21 90 top
R6  5.08,29.21 90 top
R7  2.03,29.21 90 top
R8  21.84,72.14 90 top
R9  9.91,67.06 90 top
R10  13.97,65.53 0 top
R11  57.15,38.1 180 top
R12  54.61,25.65 90 top
R13  59.69,25.65 90 top
R14  46.48,11.43 270 top
R15  19.3,72.14 270 top
R16  6.86,65.02 90 top
R17  13.97,68.58 0 top
U1  10.16,10.16 315 top
U2  31.75,31.75 270 top
U3  57.15,31.75 0 top
X1  52.7,53.34 340 bottom
X3  10.79,53.34 20 bottom
Y1  2.54,11.68 270 top

### Tracks (layer width: path | path; a pad name or v marks a point on that pad's centre or on a via)
+3V3  (via drill 0.35)
  Top 0.254: IC1.2 8.26,35.29 C9.1 12.18,35.29 v12.19,35.31 12.19,32 11.18,30.99 9.4,30.99 8.57,30.16 R5.2 R6.2 R7.2 | 32.89,35.94 32.77,36.07 C7.1 32.77,36.08 v32.77,37.59 | 32.89,35.94 35.05,33.78 35.05,31.24 | 35.05,31.24 35.56,30.73 36.31,30.73 C6.1 | U2.14 35.04,31.25 35.05,31.24 | U2.1 32.75,35.8 32.89,35.94
  Bottom 0.254: v32.77,37.59 28.7,37.59 28.19,37.08 28.19,34.29 24.89,30.99 13.46,30.99 12.19,32.26 v12.19,35.31
+5V  (via drill 0.35)
  Top 0.254: C8.1 5.01,35.29 IC1.3 | U1.6 6.94,11.68 7.37,11.68 7.49,11.81 | 7.49,11.81 8.13,12.45 8.13,12.7 7.41,13.42 U1.4 5.65,15.24 C3.1 C4.1 | 7.49,11.81 11.18,8.13 11.18,6.32 U1.18 13.17,4.32 v16.51,4.32 C2.1 | v21.59,5.59 23.37,5.59 J1.2 23.43,7.05 R1.2 | C8.1 3.56,35.81 | D13.1 C20.1 | D14.1 C21.1 | D16.1 C23.1 | D17.1 C24.1 28.45,23.83 | C25.1 D18.1 | C22.1 D15.1 | D8.1 C15.1 | D9.1 26.67,38.72 | D10.1 C17.1 | D11.1 C18.1 | D12.1 C19.1 | C8.1 2.52,35.29 2.03,34.8 2.03,32.51 v2.54,32 | D7.1 22.26,30.15 C14.1 | 24.89,33.78 23.88,33.78 23.62,34.04 22.86,34.04 21.84,35.05 v18.8,35.05 | v15.49,35.05 13.21,37.34 v2.03,37.34 | v50.8,38.35 52.31,38.35 C26.1 52.32,39.88 48.26,43.94 v45.21,43.94 | v55.12,36.07 55.24,35.94 U3.8 | J6.1 46.23,7.37 48.98,10.12 49.47,10.12 J2.4 46.8,10.16 R14.2 | v39.37,73.41 39.37,61.72 38.86,61.21 v37.85,61.21 | v9.91,69.85 R9.2
  Top 0.508: C4.1 v6.6,17.53 | 30.23,38.86 30.75,39.39 C17.1 | 30.23,38.86 28.96,37.59 27.43,37.59 | 27.43,37.59 26.67,38.35 26.67,38.72 C16.1 | 27.43,37.59 26.42,36.58 26.42,35.56 25.65,34.8 24.89,34.8 | 24.89,31.75 23.88,30.73 C14.1 | 24.89,31.75 24.89,29.46 25.4,28.96 25.4,27.43 | 25.4,27.43 25.4,27.29 26.56,27.29 28.45,25.4 28.45,23.83 | 34.04,38.86 30.23,38.86 | 34.04,38.86 34.24,38.86 C18.1 | 37.59,37.06 35.84,37.06 34.04,38.86 | 37.59,37.06 37.59,34.04 38.73,32.89 | 38.73,32.89 38.88,32.75 C20.1 | 38.73,32.89 38.73,29.08 | 38.73,29.08 36.83,27.18 36.83,25.4 | 36.83,25.4 36.83,24.79 | C19.1 37.59,37.06 | C21.1 38.73,29.08 | 36.83,25.4 C22.1 36.83,25.65 34.8,25.65 32.77,23.62 32.77,22.88 C23.1 | 25.4,27.43 C25.1 | C15.1 23.85,35.33 24.38,34.8 24.89,34.8 | 24.89,34.8 24.89,33.78 24.89,31.75 | v38.35,50.29 38.61,50.29 | 38.61,50.29 39.62,50.29 41.66,48.26 43.18,48.26 43.94,47.5 43.94,45.21 v45.21,43.94 | C38.1 v37.85,61.21 | C12.1 36.56,52.34 38.61,50.29
  Top 0.762: 37.47,62.12 C38.1 C12.1
  Top 1.524: L1.P$2 37.47,62.12
  Bottom 0.254: v16.51,4.32 20.32,4.32 v21.59,5.59 | v2.54,32 2.03,32 | v18.8,35.05 v15.49,35.05 | v50.8,38.35 53.09,36.07 v55.12,36.07 | v39.37,73.41 18.8,73.41 15.24,69.85 v9.91,69.85
  Bottom 0.508: J6.1 45.97,6.1 32.65,6.1 29.85,8.89 21.08,8.89 19.05,6.86 9.65,6.86 3.81,12.7 3.81,14.73 v6.6,17.53 9.4,20.32 9.4,21.34 8.38,22.35 3.81,22.35 2.03,24.13 2.03,32 v2.03,37.34 5.08,40.39 22.61,40.39 27.18,44.96 44.2,44.96 v45.21,43.94
+24V  (via drill 0.35)
  Top 0.254: 19.68,60.45 C35.1 | R8.2 23.11,74.36 v23.11,74.42 | v42.37,74.4 43.82,72.95 C13.1 | C32.1 55.5,66.42 53.85,64.77 51.56,64.77 50.26,63.47 X1.4
  Top 0.508: IC2.7 19.68,60.45 | C33.1 20.19,55.63 C35.1 C34.1 | C13.1 C28.1 | C28.1 C27.1 C30.1 | C31.1 C29.1 45.34,70.87 C28.1
  Top 0.762: C31.1 46.86,65.31 X1.4 | X3.5 12.37,57.73 14.48,55.63 20.19,55.63
  Bottom 0.254: v23.11,74.42 42.35,74.42 v42.37,74.4 | 14.32,61.48 X3.4
  Bottom 1.27: X3.5 14.32,61.48 16.35,63.5 48.67,63.5 X1.4 50.26,59.41 X1.5
A0  (via drill 0.35)
  Top 0.254: U1.23 15.27,7.87 15.75,7.87 16.51,8.64 | 16.51,8.64 | v18.29,9.91 18.03,9.65 17.52,9.65 16.51,8.64
A1  (via drill 0.35)
  Top 0.254: U1.24 15.71,9.11 v17.02,10.41
A2  (via drill 0.35)
  Top 0.254: U1.25 18.76,11.21 v19.56,10.41
A3  (via drill 0.35)
  Top 0.254: D7.4 13.93,17.56 v13.97,17.53 | U1.26 15.27,12.45 16,12.45 v16.26,12.19
  Bottom 0.254: v13.97,17.53 16.26,15.24 v16.26,12.19
A4
  Top 0.254: U1.27 14.9,13.21 16.49,13.21 17.51,12.19 PAD3.1
A5
  Top 0.254: U1.28 14.28,13.72 PAD4.1
A6  (via drill 0.35)
  Top 0.254: U1.19 13.04,5.59 v16.51,5.59
A7  (via drill 0.35)
  Top 0.254: U1.22 14.65,7.37 15.96,7.37 17.48,8.89 v18.03,8.89
AREF
  Top 0.254: U1.20 13.4,6.35 16.38,6.35 | 16.38,6.35 | 16.38,6.35 16.76,6.35 17.02,6.6 C5.2
BST
  Top 0.508: C10.1 21.44,62.5 IC2.8
COMP
  Top 0.254: 17,70.63 C36.1
  Top 0.508: IC2.3 18.41,69.22 17,70.63
D2
  Top 0.254: U1.32 10.67,15.72 10.67,16.76 12.7,18.8 D5.C
D3
  Top 0.254: D6.C 10.41,17.78 9.4,16.76 9.4,15.47 U1.1
D5  (via drill 0.35)
  Top 0.254: U1.9 5.11,9.14 v2.29,9.14 | v39.88,3.05 39.96,3.05 Q3.1
  Bottom 0.254: v2.29,9.14 2.29,8.13 2.79,7.62 3.81,7.62 4.32,7.11 4.32,3.81 6.86,1.27 38.1,1.27 v39.88,3.05
D6  (via drill 0.35)
  Top 0.254: U1.10 5.05,7.87 4.32,7.87 3.81,8.38 v3.3,8.38 | v35.81,3.05 36.81,2.05 Q2.1
  Bottom 0.254: v3.3,8.38 3.81,8.38 4.83,7.37 4.83,4.06 | 4.83,5.08 4.83,4.06 | 4.83,4.06 7.11,1.78 30.99,1.78 32.26,3.05 v35.81,3.05
D7
  Top 0.254: U1.11 5.16,6.86 PAD1.1
D8
  Top 0.254: U1.12 5.02,5.59 PAD2.1
D9
  Top 0.254: Q1.1 32.05,1.27 10.71,1.27 | 10.71,1.27 | U1.13 6.56,5.99 6.56,4.77 10.05,1.27 10.71,1.27
DIR  (via drill 0.35)
  Top 0.254: U1.2 7.87,15.27 v7.87,16.26 | v12.19,16.51 19.81,16.51 22.61,13.72 27.69,13.72 28.96,12.45 34.54,12.45 35.81,13.72 41.15,13.72 50.55,23.11 55.88,23.11 57.02,24.26 57.02,27.81 | U3.2 56.52,28.32 57.02,27.81 | 57.02,27.81 57.15,27.69 57.66,28.19 57.66,28.82 U3.3
  Bottom 0.254: v7.87,16.26 8.13,16.51 v12.19,16.51
EN
  Top 0.254: IC2.2 19.68,70.81 R15.2 R8.1
FB
  Top 0.254: R9.1 9.94,66.07 10.23,65.79 11.75,64.26 14.41,64.26 14.92,64.77 R10.2 14.92,65.97 17.14,68.2 IC2.4 17.14,68.52
FREQ
  Top 0.254: IC2.6 18.41,62.48 17.78,61.85 15.88,61.85 13.97,63.75 11.54,63.75 10.52,64.77 9.65,64.77 9.4,64.77 8.89,64.77 7.69,65.97 R16.2
GND  (via drill 0.35)
  Top 0.254: U1.5 6.04,13.72 v5.33,13.72 2.54,13.72 | 1.02,12.19 1.02,13.21 1.52,13.72 2.54,13.72 | 1.02,12.19 1.52,11.68 Y1.2 | 9.4,12.62 U1.3 | 9.4,12.62 9.4,11.49 U1.21 14.03,6.86 16.17,6.86 17.18,7.87 19.3,7.87 | v9.4,12.7 9.4,12.62 | 20.07,7.87 20.05,7.86 C5.1 C2.2 20.3,4.06 v21.59,4.06 | 20.07,7.87 v21.59,7.87 | J1.6 28.96,6.35 27.43,7.87 v25.4,7.87 | Q1.2 35.76,1.02 38.86,1.02 | 38.86,1.02 41.83,1.02 Q3.2 42.88,2.03 43.94,2.03 44.7,2.79 44.7,7.37 44.96,7.62 v44.96,10.41 44.96,13.21 46.99,15.24 J2.6 48.26,15.24 | Q2.2 38.8,1.08 38.86,1.02 | 1.02,12.19 v1.02,8.64 | 19.3,7.87 v19.3,8.89 | 20.07,7.87 19.3,7.87 | 30.77,22.8 31.75,19.05 D16.3 | v22.61,37.85 24.39,37.11 20.83,38.1 D8.3 | 40.16,35.52 v41.4,36.58 | 40.16,35.52 40.03,35.41 42.93,38.1 D12.3 | v40.89,25.91 39.41,26.31 39.17,26.38 42.93,25.4 D14.3 | v31.24,20.83 30.77,22.8 | D17.3 25.4,20.83 C24.2 v25.91,22.61 | 23.47,28.09 C25.2 | 23.47,28.09 20.83,25.4 D18.3 | D15.3 38.1,20.83 C22.2 v36.83,22.1 | 40.87,30.81 C20.2 | 40.87,30.81 44.45,31.75 D13.3 | 14.4,33.35 D7.3 19.05,31.75 C14.2 v21.08,32.26 | D9.3 25.4,42.67 C16.2 v26.92,41.4 | D10.3 31.75,44.45 32.69,40.87 | 32.69,40.87 C17.2 | D11.3 38.1,42.67 37.11,39.11 | 37.11,39.11 C18.2 | v32.51,42.67 32.69,40.87 | v37.85,40.89 37.11,39.11 | v42.67,31.24 40.87,30.81 | v22.1,26.67 23.47,28.09 | C6.2 v36.32,34.54 | 30.73,36.08 C7.2 | U2.5 C7.2 | U2.10 31.25,29.73 30.99,29.46 30.99,28.96 | 30.99,28.96 30.99,28.95 30.99,28.9 31.44,28.45 32.06,28.45 32.51,28.9 32.51,29.52 32.25,29.78 U2.12 | 30.99,28.96 v30.99,27.94 | 10.67,33.27 v10.67,32 | 10.67,33.27 C9.2 | C7.2 v29.21,36.07 | v4.57,32 4.57,32.27 C8.2 3.61,33.34 4.18,32.77 7.11,32.77
  Top 0.254: U3.5 59.05,33.66 58.42,33.02 54.61,33.02 52.32,35.31 52.32,36.32 | 52.32,36.32 C26.2 | 52.32,36.32 53.34,36.32 54.1,37.08 54.1,39.12 48.51,44.7 v47.24,44.7 | 2.54,13.72 2.56,13.73 C3.2 C4.2 | C19.2 40.14,35.52 40.16,35.52 | C23.2 30.77,22.84 30.77,22.8 | 10.67,33.27 8.28,33.27 IC1.1 7.64,32.77 7.11,32.77 | 7.11,32.77 7.1,32.77 | C35.2 C34.2 | C34.2 C33.2 | C34.2 D20.A 26.17,57.4 C12.2 | R15.1 17.21,73.09 v17.02,72.9 | v13.21,70.87 12.95,70.87 11.68,69.6 11.68,67.31 v11.81,67.18 11.94,67.06 13.02,67.06 | R17.1 13.02,67.06 | 13.02,67.06 R10.1 | 17.14,64.64 v17.02,64.77 | v17.02,65.79 v18.03,65.79 | v18.03,64.77 v19.05,64.77 | v19.05,65.79 v20.07,65.79 | v20.07,64.77 v21.08,64.77 | v21.08,65.79 v21.08,66.8 | v20.07,66.8 v19.05,66.8 | v18.03,66.8 v17.02,66.8 | v34.8,65.02 33.27,63.5 v33.27,61.21 v32.26,61.21 | v33.78,65.02 v32.77,65.02 | v31.75,65.02 v30.73,65.02 | v29.72,65.02 v28.7,65.02 | v28.7,66.04 v29.72,66.04 | v30.73,66.04 v31.75,66.04 | v32.77,66.04 v33.78,66.04 | v31.24,61.21 v30.23,61.21 | R16.1 7.72,63.21 X3.8 | v12.45,38.86 v12.45,41.66 | v13.72,41.66 v14.99,41.66
  Top 0.508: v8.13,17.53 8.13,17.78 6.86,19.05 3.05,19.05 2.56,18.56 C4.2 | C21.2 39.07,26.31 39.41,26.31 | C15.2 24.51,37.11 24.39,37.11 | C29.2 v49.66,69.09 C31.2 C32.2 | C13.2 C28.2 v41.02,67.56 C27.2 C30.2 | IC2.5 17.14,64.64
  Top 0.635: X1.3 51.02,59.96 50.51,60.47 48.45,60.47 X1.6 | X3.3 13.68,59.73 13.68,60.16 12.92,60.92 12.92,61.47 X3.6
  Bottom 0.254: v5.33,13.72 8.38,13.72 v9.4,12.7 | v21.59,7.87 22.1,7.87 22.35,8.13 25.15,8.13 v25.4,7.87 | v19.3,8.89 20.83,10.41 PAD5.1 v44.96,10.41 | 22.54,37.61 v21.08,32.26 | 22.54,37.61 v22.61,37.85 20.83,36.07 15.24,36.07 | v22.1,26.67 v25.91,22.61 v31.24,20.83 v36.83,22.1 v40.89,25.91 v42.67,31.24 v41.4,36.58 v37.85,40.89 v32.51,42.67 v26.92,41.4 22.56,37.67 22.54,37.61 | v30.99,27.94 33.53,27.94 36.32,30.73 v36.32,34.54 33.78,34.54 33.53,34.8 31.24,34.8 29.5,34.8 | v10.67,32 10.92,32 12.45,30.48 25.19,30.48 29.5,34.8 | v29.21,36.07 29.21,35.09 29.5,34.8 | v4.57,32 4.32,31.75 3.81,31.75 | v47.24,44.7 45.72,43.18 44.7,43.18 43.69,44.2 27.94,44.2 23.11,39.37 13.97,39.37 | v17.02,72.9 14.99,70.87 v13.21,70.87 | v17.02,64.77 17.27,64.77 17.27,65.53 v17.02,65.79 | v18.03,65.79 v18.03,64.77 | v19.05,64.77 v19.05,65.79 | v20.07,65.79 v20.07,64.77 | v21.08,64.77 v21.08,65.79 | v21.08,66.8 v20.07,66.8 | v19.05,66.8 v18.03,66.8 | v34.8,65.02 v33.78,65.02 | v32.77,65.02 v31.75,65.02 | v30.73,65.02 v29.72,65.02 | v28.7,65.02 v28.7,66.04 | v29.72,66.04 v30.73,66.04 | v31.75,66.04 v32.77,66.04 | v33.78,66.04 v34.8,66.04 | v32.26,61.21 v31.24,61.21 | v30.23,61.21 v29.21,61.21 | v11.81,67.18 16.64,67.18 v17.02,66.8 | v41.02,67.56 48.14,67.56 v49.66,69.09 51.82,69.09 51.31,68.58 51.31,62.21 51.43,61.86 51.31,61.59 51.31,60.97 X1.3 | 12.7,38.86 v12.45,38.86 | v12.45,41.66 v13.72,41.66 | v14.99,41.66 14.99,43.69 9.4,49.28 9.4,59.7 10.09,60.39 | X1.8 47.01,60.17 X1.6 47.87,58.55 X1.7 45.6,60.17 X1.8
  Bottom 0.508: v8.13,17.53 10.41,19.81 10.41,21.84 8.89,23.37 4.06,23.37 3.05,24.38 3.05,30.99 3.81,31.75 3.81,37.59 5.08,38.86 v12.45,38.86 | 13.46,38.86 12.7,38.86 | 13.46,38.86 13.97,39.37 | 15.24,36.07 15.24,37.08 13.46,38.86
  Bottom 0.635: X3.8 11.18,63.21 X3.6 10.09,60.39 X3.7
  pour Bottom: 0,63.5 63.5,63.5 63.5,0 0,0
  pour Top: 35.05,61.98 29.21,61.98 27.18,59.69 24.89,59.69 23.88,60.71 22.35,60.71 22.35,53.59 23.88,53.59 26.67,56.39 26.92,56.39 27.18,56.64 35.05,56.64
  pour Top: 28.45,73.91 28.45,61.21 28.96,60.71 34.04,60.71 35.05,61.72 35.31,61.98 35.31,65.79 35.31,73.91
  pour Top: 16.51,67.56 21.59,67.56 21.84,67.31 21.84,64.26 21.59,64.01 16.76,64.01 16.51,64.01
  pour Bottom: 62.48,63.75 49.53,76.71 30.99,76.71 13.97,76.71 1.02,63.75
INT1  (via drill 0.35)
  Top 0.254: D5.A v12.7,26.92 | U2.11 v31.75,29.21
  Bottom 0.254: v12.7,26.92 13.21,27.43 28.7,27.43 29.02,27.43 30.79,29.21 v31.75,29.21
INT2  (via drill 0.35)
  Top 0.254: U2.9 30.75,29.99 28.96,28.19 v28.7,28.19 | v11.3,26.92 11.3,26.61 D6.A
  Bottom 0.254: v28.7,28.19 28.45,27.94 12.32,27.94 v11.3,26.92
MISO  (via drill 0.35)
  Top 0.254: D3.C v6.1,20.83 | U1.16 v10.05,4.2 11.96,2.29 22.61,2.29 J1.1
  Bottom 0.254: v6.1,20.83 2.29,17.02 2.29,12.19 6.35,8.13 6.35,4.83 7.06,4.12 7.87,4.12 8.38,4.62 9.35,4.62 9.65,4.32 9.93,4.32 v10.05,4.2
MISO_3.3V  (via drill 0.35)
  Top 0.254: U2.7 29.46,31.75 28.96,31.24 28.96,30.99 v28.7,30.73 | v6.6,26.92 6.1,26.42 D3.A
  Bottom 0.254: v28.7,30.73 28.7,30.23 27.43,28.96 8.64,28.96 v6.6,26.92
MOSI  (via drill 0.35)
  Top 0.254: D2.C v4.06,20.83 | U1.15 8.08,5.25 8.08,4.62 8.76,3.94 | 12.17,1.78 | 12.17,1.78 10.92,1.78 8.76,3.94 | 12.17,1.78 29.72,1.78 v30.73,2.79 | v8.76,3.87 8.76,3.94
  Bottom 0.254: v4.06,20.83 1.78,18.54 1.78,11.94 5.84,7.87 5.84,4.62 6.85,3.61 8.51,3.61 v8.76,3.87 | J1.4 28.19,7.87 29.97,7.87 30.73,7.11 v30.73,2.79
MOSI_3.3V  (via drill 0.35)
  Top 0.254: R6.1 4.06,27.24 D2.A 4.83,26.49 v4.83,26.92 | U2.6 28.95,32.25 v27.43,30.73
  Bottom 0.254: v27.43,30.73 27.43,29.97 26.92,29.46 7.37,29.46 v4.83,26.92
N$1
  Top 0.254: R2.1 32.83,5.1 Q1.3
N$2
  Top 0.254: D8.4 15.51,36.93 D7.2
N$3
  Top 0.254: D9.4 21.46,39.59 D8.2
N$4
  Top 0.254: R2.2 34.73,7.18 J3.1
N$5
  Top 0.254: R3.1 36.9,5.1 Q2.3
N$6
  Top 0.254: R3.2 38.8,8.19 J4.1
N$7
  Top 0.254: R4.1 40.96,5.1 Q3.3
N$8
  Top 0.254: R4.2 42.86,8.57 J5.1
N$9
  Top 0.254: D10.4 30.15,46.87 D9.2
N$10
  Top 0.254: D10.2 36.93,47.99 D11.4
N$11
  Top 0.254: D11.2 39.59,42.04 D12.4
N$12
  Top 0.254: D13.4 46.22,36.7 D12.2
N$13
  Top 0.254: D13.2 47.99,26.57 D14.4
N$14
  Top 0.254: D14.2 42.04,23.91 D15.4
N$15
  Top 0.254: D15.2 36.7,17.28 D16.4
N$16
  Top 0.254: D16.2 26.57,15.51 D17.4
N$17
  Top 0.254: D18.4 23.91,21.46 D17.2
N$25
  Top 0.254: C36.2 15,68.66 R17.2
N$30
  Top 0.254: U3.1 55.24,27.24 R12.2
N$31
  Top 0.254: U3.4 59.05,27.24 R13.2
RESET
  Top 0.254: U1.29 14.42,14.99 19.05,14.99 21.84,12.19 26.92,12.19 27.96,11.16 C1.2 | R1.1 C1.2 | J1.5 30.73,5.33 30.73,7.11 29.72,8.13 28.45,8.13 27.94,8.64 27.94,9.64 C1.2
RESET_EXT  (via drill 0.35)
  Top 0.254: C1.1 31.23,10.92 35.31,10.92 36.58,12.19 41.91,12.19 46.48,16.76 v51.05,16.76 | J2.1 51.31,2.54 53.09,4.32 53.09,16 v53.85,16.76
  Bottom 0.254: v51.05,16.76 v53.85,16.76 54.1,16.76
RS485A
  Top 0.254: U3.6 57.78,37.78 R11.1 57.91,38.29 57.91,39.12 57.4,39.62 55.63,39.62 53.34,41.91 53.34,57.15 56.39,60.2 56.39,61.47 55.08,62.78 X1.2
  Bottom 0.508: 15.75,56.64 15.75,57.84 16.07,58.71 16.07,59.86
  Bottom 0.635: X1.2 55.08,62.78 56.39,61.47 56.39,60.2 51.56,55.37 17.02,55.37 15.75,56.64 | X3.2 16.07,59.86
RS485B
  Top 0.254: U3.7 56.52,37.78 R11.2 52.32,41.98 52.32,57.66 54.71,60.04 X1.1
  Bottom 0.635: X1.1 54.71,60.3 51.05,56.64 18.29,56.64 X3.1
RX  (via drill 0.35)
  Top 0.254: U1.30 13.8,15.49 19.3,15.49 22.1,12.7 27.18,12.7 28.45,11.43 35.05,11.43 36.32,12.7 41.66,12.7 46.99,18.03 47.75,18.03 | J2.3 51.31,7.62 52.07,8.38 52.07,13.97 | 52.07,13.97 52.07,17.02 51.05,18.03 47.75,18.03 | 47.75,18.03 48.51,18.8 48.51,19.56 50.8,21.84 v51.31,21.84 | v51.31,24.13 51.88,24.7 R12.1 | R14.1 46.48,13.21 47.24,13.97 52.07,13.97
  Bottom 0.254: v51.31,21.84 v51.31,24.13
SCK  (via drill 0.35)
  Top 0.254: D4.C v2.03,20.83 | U1.17 v13.26,3.1 13.57,2.79 21.84,2.79 v22.1,3.05
  Bottom 0.254: v2.03,20.83 1.27,20.07 1.27,11.68 5.33,7.62 5.33,4.41 6.64,3.1 7.87,3.1 | v22.1,3.05 22.35,3.05 23.11,2.29 25.15,2.29 J1.3 | 7.87,3.1 v13.26,3.1 | 7.87,3.1
SCK_3.3V  (via drill 0.35)
  Top 0.254: R7.1 D4.A 2.03,24.89 2.79,24.13 8.89,24.13 9.4,24.64 9.4,26.42 11.43,28.45 v11.43,30.23 | U2.4 31.25,33.79 v31.5,34.04
  Bottom 0.254: v31.5,34.04 29.46,34.04 26.42,30.99 26.42,30.23 26.16,29.97 11.68,29.97 v11.43,30.23
SS  (via drill 0.35)
  Top 0.254: D1.C v8.13,20.83 | 7.97,6.2 U1.14 7.32,5.62 v7.32,5.08
  Bottom 0.254: v8.13,20.83 2.79,15.49 2.79,12.45 7.32,7.92 v7.32,5.08
SS_3.3V  (via drill 0.35)
  Top 0.254: U2.8 29.73,31.25 29.46,30.99 v29.46,29.97 | 8.13,28.19 D1.A | 8.13,28.19 R5.1 | v9.65,28.19 8.13,28.19
  Bottom 0.254: v29.46,29.97 29.21,29.97 27.69,28.45 9.91,28.45 v9.65,28.19
SW
  Top 0.254: 24.77,64.52 24.77,63.38 D20.C | C10.2 23.13,64.52 24.77,64.52 | 25.91,64.01 25.4,64.52 24.77,64.52
  Top 0.508: 23.5,68.59 IC2.1
  Top 0.991: L1.P$1 23.5,68.59
  Top 1.27: 24.77,64.52 L1.P$1 | D20.C 25.91,64.01
  pour Top: 20.83,69.09 22.35,69.09 23.37,70.1 23.37,72.39 23.37,72.9 23.88,73.41 25.4,73.41 26.92,73.41 27.69,72.64 27.69,61.72 27.43,61.47 24.89,61.47 24.64,61.72 24.64,63.75 24.38,64.01 22.35,64.01 22.35,67.56 21.84,68.07 20.83,68.07
TX  (via drill 0.35)
  Top 0.254: U1.31 13.17,16 19.56,16 22.35,13.21 27.43,13.21 28.7,11.94 34.8,11.94 36.07,13.21 41.4,13.21 47.22,19.02 v47.53,19.02 47.53,19.33 50.8,22.61 56.39,22.61 58.49,24.7 R13.1 | J2.2 51.31,5.08 52.58,6.35 52.58,17.27 50.8,19.05 v49.53,19.05
  Bottom 0.254: v47.53,19.02 47.56,19.05 v49.53,19.05
XTAL1
  Top 0.254: Y1.1 4.61,12.88 U1.7
XTAL2
  Top 0.254: Y1.3 4.41,10.48 U1.8

### Text on the board
tNames: Led Sphere 2017
bNames: Led Sphere 2017 / Brooklyn Research / Think Create LLC